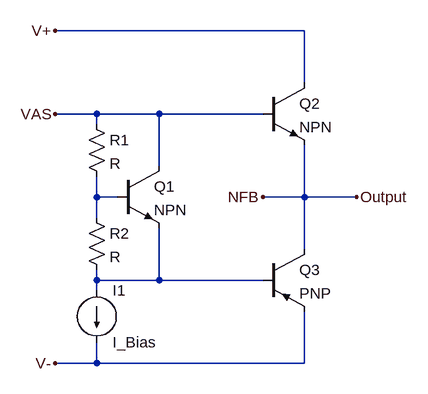
[diagram p0: schematic output_stage_pa.asc]
output_stage_pa.asc, the LTspice schematic file:
Version 4
SHEET 1 880 680
WIRE 432 -64 48 -64
WIRE 432 16 432 -64
WIRE 112 64 48 64
WIRE 208 64 112 64
WIRE 368 64 208 64
WIRE 112 80 112 64
WIRE 208 144 208 64
WIRE 112 192 112 160
WIRE 144 192 112 192
WIRE 432 192 432 112
WIRE 432 192 368 192
WIRE 512 192 432 192
WIRE 112 224 112 192
WIRE 432 272 432 192
WIRE 112 320 112 304
WIRE 208 320 208 240
WIRE 208 320 112 320
WIRE 368 320 208 320
WIRE 112 336 112 320
WIRE 112 448 112 416
WIRE 112 448 48 448
WIRE 432 448 432 368
WIRE 432 448 112 448
FLAG 48 -64 V+
FLAG 48 448 V-
FLAG 512 192 Output
FLAG 368 192 NFB
FLAG 48 64 VAS
SYMBOL npn 144 144 R0
SYMATTR InstName Q1
SYMBOL res 96 64 R0
SYMATTR InstName R1
SYMBOL res 96 208 R0
SYMATTR InstName R2
SYMBOL npn 368 16 R0
SYMATTR InstName Q2
SYMBOL pnp 368 272 R0
SYMATTR InstName Q3
SYMBOL current 112 336 R0
WINDOW 123 0 0 Left 0
WINDOW 39 0 0 Left 0
SYMATTR InstName I1
SYMATTR Value I_Bias

The netlist it stands for:
* output_stage_pa.asc
Q1 VAS N001 N002 0 NPN
R1 VAS N001 R
R2 N001 N002 R
Q2 V+ VAS NFB 0 NPN
Q3 NFB N002 V- 0 PNP
I1 N002 V- I_Bias
.model NPN NPN
.model PNP PNP
.lib standard.bjt
.backanno
.end